# Altium schematic sheet Led7Seg.SchDoc
size A4
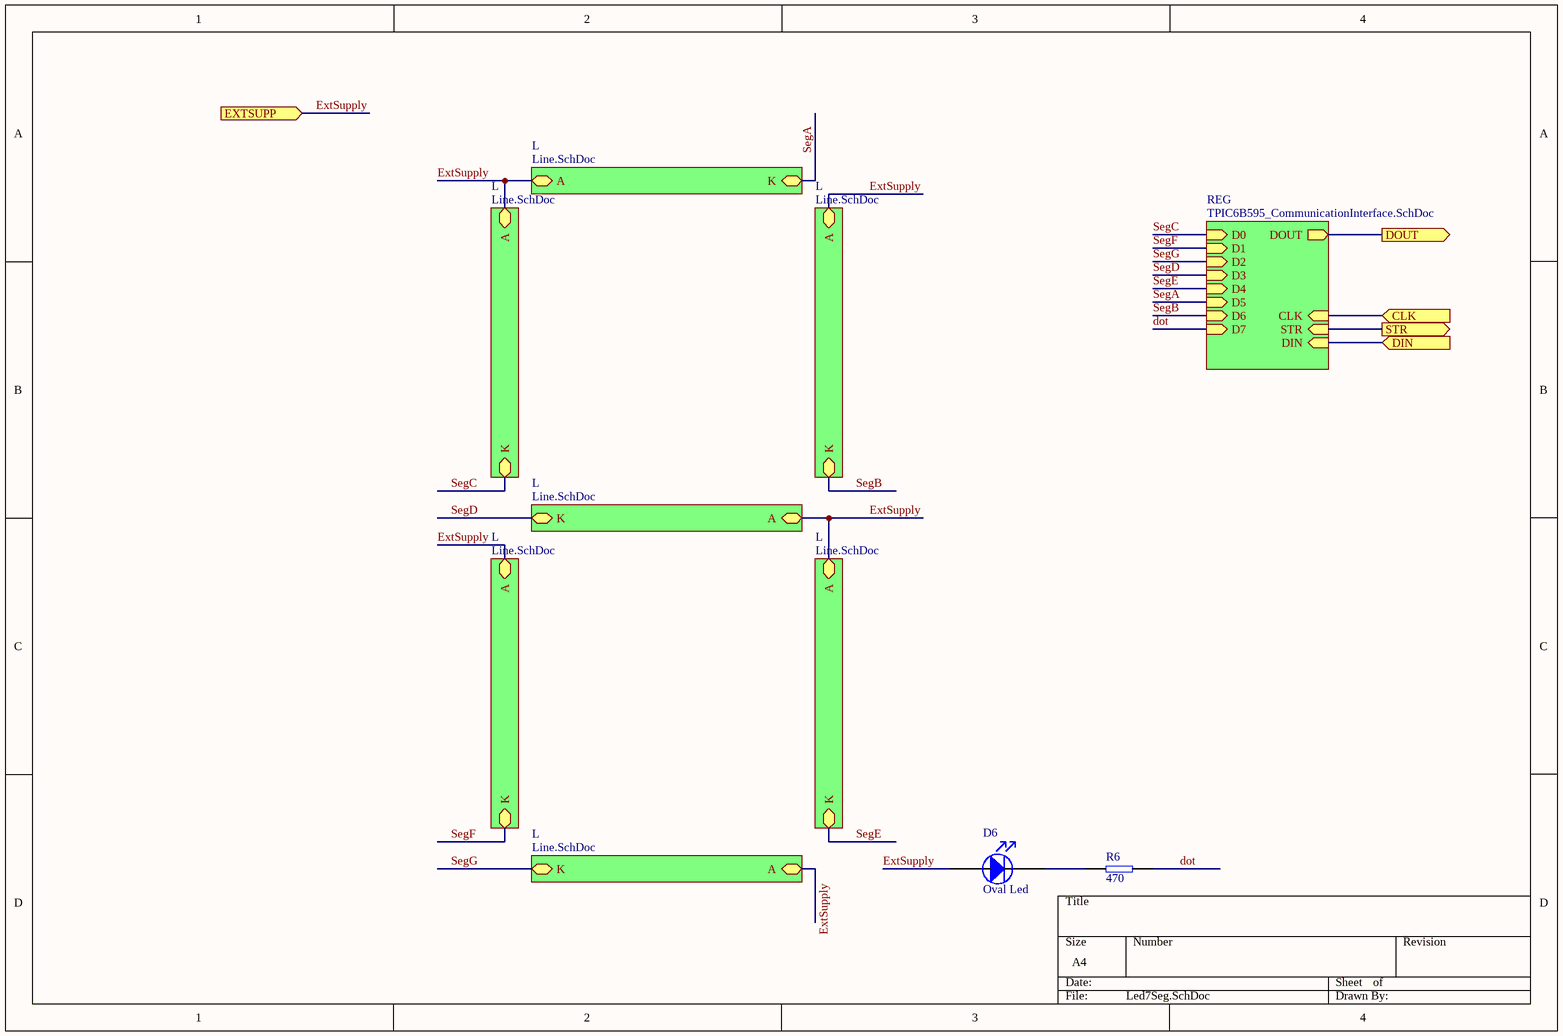
[diagram p0: Led7Seg.SchDoc]

## Parts
D6  Oval Led  [LED]
R6  value 470  [RES2512]  (hidden comment: RES470)

## Sub-sheets
L = Line.SchDoc: A, K
L = Line.SchDoc: A, K
L = Line.SchDoc: A, K
L = Line.SchDoc: A, K
L = Line.SchDoc: A, K
L = Line.SchDoc: A, K
L = Line.SchDoc: A, K
REG = TPIC6B595_CommunicationInterface.SchDoc: D0 (in), D1 (in), D2 (in), D3 (in), D4 (in), D5 (in), D6 (in), D7 (in), DIN (in), DOUT (out), STR (in), CLK (in)

## Ports
CLK (in), DIN (in), DOUT (out), EXTSUPP (in), STR (out)

## Nets
CLK: port CLK, sheet REG/CLK
DIN: port DIN, sheet REG/DIN
dot: R6.2(neg) ; sheet REG/D7
DOUT: port DOUT, sheet REG/DOUT
ExtSupply: D6.A(Anode) ; port EXTSUPP, sheet L/A, sheet L/A, sheet L/A, sheet L/A, sheet L/A, sheet L/A, sheet L/A
SegA: sheet L/K, sheet REG/D5
SegB: sheet L/K, sheet REG/D6
SegC: sheet L/K, sheet REG/D0
SegD: sheet L/K, sheet REG/D3
SegE: sheet L/K, sheet REG/D4
SegF: sheet L/K, sheet REG/D1
SegG: sheet L/K, sheet REG/D2
STR: port STR, sheet REG/STR
NetD6_K: D6.K(Cathode) R6.1(pos)

## Library data of the parts
D6 = Oval Led: LED estándar - Montaje interfacial Red Oval LED; MPN: C566C-RFN-CV0W0BB2; Value: 2200 mcd 70x35 deg; Supplier: Mouser; Supplier PN: 941-C566CRFNCV0W0BB2
R6 = RES470: Resistores de película gruesa - SMD 1watt 470ohms 5%; MPN: CRCW2512470RJNEG; Supplier: Mouser; Supplier PN: 71-CRCW2512J-470-E3